# Altium schematic sheet Main_circuit.SchDoc
size A3
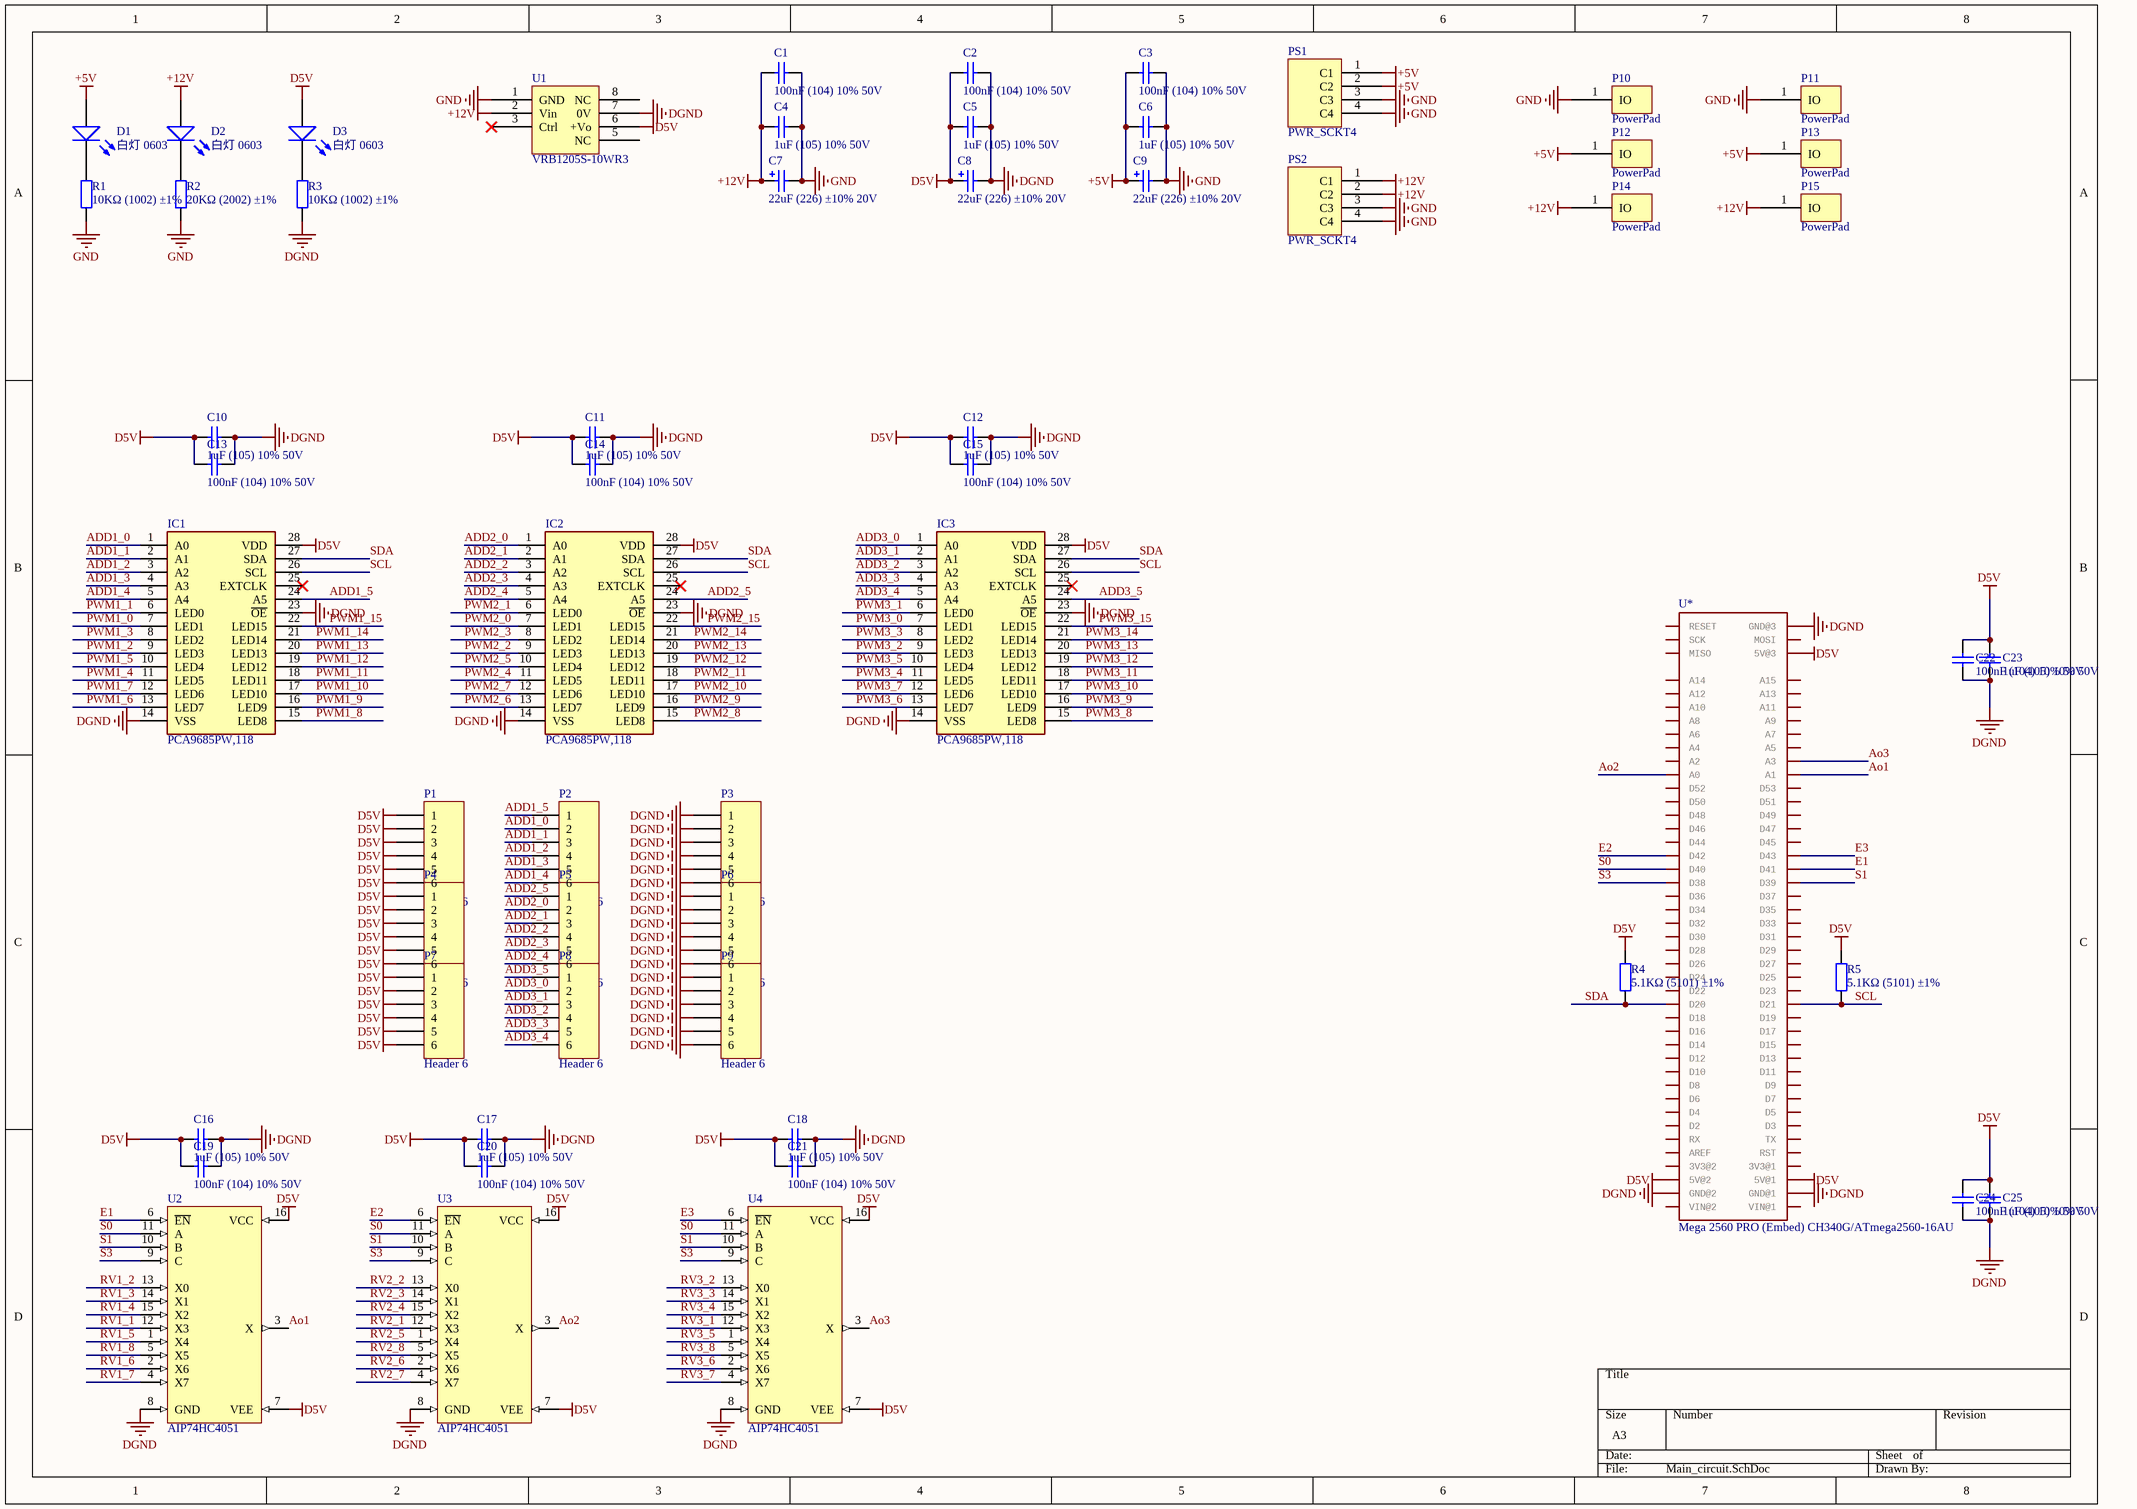
[diagram p0: Main_circuit.SchDoc]

## Parts
C1  100nF (104) 10% 50V  [LC-0603_C]
C2  100nF (104) 10% 50V  [LC-0603_C]
C3  100nF (104) 10% 50V  [LC-0603_C]
C4  1uF (105) 10% 50V  [LC-0603_C]
C5  1uF (105) 10% 50V  [LC-0603_C]
C6  1uF (105) 10% 50V  [LC-0603_C]
C7  22uF (226) ±10% 20V  [LC-CASE-B_3528]
C8  22uF (226) ±10% 20V  [LC-CASE-B_3528]
C9  22uF (226) ±10% 20V  [LC-CASE-B_3528]
C10  1uF (105) 10% 50V  [LC-0603_C]
C11  1uF (105) 10% 50V  [LC-0603_C]
C12  1uF (105) 10% 50V  [LC-0603_C]
C13  100nF (104) 10% 50V  [LC-0603_C]
C14  100nF (104) 10% 50V  [LC-0603_C]
C15  100nF (104) 10% 50V  [LC-0603_C]
C16  1uF (105) 10% 50V  [LC-0603_C]
C17  1uF (105) 10% 50V  [LC-0603_C]
C18  1uF (105) 10% 50V  [LC-0603_C]
C19  100nF (104) 10% 50V  [LC-0603_C]
C20  100nF (104) 10% 50V  [LC-0603_C]
C21  100nF (104) 10% 50V  [LC-0603_C]
C22  100nF (104) 10% 50V  [LC-0603_C]
C23  1uF (105) 10% 50V  [LC-0603_C]
C24  100nF (104) 10% 50V  [LC-0603_C]
C25  1uF (105) 10% 50V  [LC-0603_C]
D1  白灯 0603  [LC-0603_LED_S1]
D2  白灯 0603  [LC-0603_LED_S1]
D3  白灯 0603  [LC-0603_LED_S1]
IC1  PCA9685PW,118  [LC-TSSOP-28]
IC2  PCA9685PW,118  [LC-TSSOP-28]
IC3  PCA9685PW,118  [LC-TSSOP-28]
P1  Header 6  [HDR1X6]
P2  Header 6  [HDR1X6]
P3  Header 6  [HDR1X6]
P4  Header 6  [HDR1X6]
P5  Header 6  [HDR1X6]
P6  Header 6  [HDR1X6]
P7  Header 6  [HDR1X6]
P8  Header 6  [HDR1X6]
P9  Header 6  [HDR1X6]
P10  PowerPad  [PowerPad]
P11  PowerPad  [PowerPad]
P12  PowerPad  [PowerPad]
P13  PowerPad  [PowerPad]
P14  PowerPad  [PowerPad]
P15  PowerPad  [PowerPad]
PS1  PWR_SCKT4  [PWR_SCKT_4P3.81]
PS2  PWR_SCKT4  [PWR_SCKT_4P3.81]
R1  10KΩ (1002) ±1%  [LC-0603_R]
R2  20KΩ (2002) ±1%  [LC-0603_R]
R3  10KΩ (1002) ±1%  [LC-0603_R]
R4  5.1KΩ (5101) ±1%  [LC-0603_R]
R5  5.1KΩ (5101) ±1%  [LC-0603_R]
U1  VRB1205S-10WR3  [VRB1205S-10WR3]
U2  AIP74HC4051  [LC-SOP-16_150mil]
U3  AIP74HC4051  [LC-SOP-16_150mil]
U4  AIP74HC4051  [LC-SOP-16_150mil]
U*  Mega 2560 PRO (Embed) CH340G/ATmega2560-16AU  [Mega 2560 PRO (Embed)]

## Nets
+5V: C3.2 C6.2 C9.1 D1.A P12.1(IO) P13.1(IO) PS1.1(C1) PS1.2(C2)
+12V: C1.2 C4.2 C7.1 D2.A P14.1(IO) P15.1(IO) PS2.1(C1) PS2.2(C2) U1.2(Vin)
D5V: C2.2 C5.2 C8.1 C10.1 C11.1 C12.1 C13.1 C14.1 C15.1 C16.1 C17.1 C18.1 C19.1 C20.1 C21.1 C22.1 C23.1 C24.1 C25.1 D3.A IC1.28(VDD) IC2.28(VDD) IC3.28(VDD) P1.1 P1.2 P1.3 P1.4 P1.5 P1.6 P4.1 P4.2 P4.3 P4.4 P4.5 P4.6 P7.1 P7.2 P7.3 P7.4 P7.5 P7.6 R4.2 R5.2 U1.6(+Vo) U2.7(VEE) U2.16(VCC) U3.7(VEE) U3.16(VCC) U4.7(VEE) U4.16(VCC) U*.5V@1 U*.5V@2 U*.5V@3
DGND: C2.1 C5.1 C8.2 C10.2 C11.2 C12.2 C13.2 C14.2 C15.2 C16.2 C17.2 C18.2 C19.2 C20.2 C21.2 C22.2 C23.2 C24.2 C25.2 IC1.14(VSS) IC1.23(~{OE}) IC2.14(VSS) IC2.23(~{OE}) IC3.14(VSS) IC3.23(~{OE}) P3.1 P3.2 P3.3 P3.4 P3.5 P3.6 P6.1 P6.2 P6.3 P6.4 P6.5 P6.6 P9.1 P9.2 P9.3 P9.4 P9.5 P9.6 R3.1 U1.7(0V) U2.8(GND) U3.8(GND) U4.8(GND) U*.GND@1 U*.GND@2 U*.GND@3
GND: C1.1 C3.1 C4.1 C6.1 C7.2 C9.2 P10.1(IO) P11.1(IO) PS1.3(C3) PS1.4(C4) PS2.3(C3) PS2.4(C4) R1.1 R2.1 U1.1(GND)
ADD1_0: IC1.1(A0) P2.2
ADD1_1: IC1.2(A1) P2.3
ADD1_2: IC1.3(A2) P2.4
ADD1_3: IC1.4(A3) P2.5
ADD1_4: IC1.5(A4) P2.6
ADD1_5: IC1.24(A5) P2.1
ADD2_0: IC2.1(A0) P5.2
ADD2_1: IC2.2(A1) P5.3
ADD2_2: IC2.3(A2) P5.4
ADD2_3: IC2.4(A3) P5.5
ADD2_4: IC2.5(A4) P5.6
ADD2_5: IC2.24(A5) P5.1
ADD3_0: IC3.1(A0) P8.2
ADD3_1: IC3.2(A1) P8.3
ADD3_2: IC3.3(A2) P8.4
ADD3_3: IC3.4(A3) P8.5
ADD3_4: IC3.5(A4) P8.6
ADD3_5: IC3.24(A5) P8.1
Ao1: U2.3(X) U*.A1
Ao2: U3.3(X) U*.A0
Ao3: U4.3(X) U*.A3
E1: U2.6(~{EN}) U*.D41
E2: U3.6(~{EN}) U*.D42
E3: U4.6(~{EN}) U*.D43
PWM1_0: IC1.7(LED1)
PWM1_1: IC1.6(LED0)
PWM1_2: IC1.9(LED3)
PWM1_3: IC1.8(LED2)
PWM1_4: IC1.11(LED5)
PWM1_5: IC1.10(LED4)
PWM1_6: IC1.13(LED7)
PWM1_7: IC1.12(LED6)
PWM1_8: IC1.15(LED8)
PWM1_9: IC1.16(LED9)
PWM1_10: IC1.17(LED10)
PWM1_11: IC1.18(LED11)
PWM1_12: IC1.19(LED12)
PWM1_13: IC1.20(LED13)
PWM1_14: IC1.21(LED14)
PWM1_15: IC1.22(LED15)
PWM2_0: IC2.7(LED1)
PWM2_1: IC2.6(LED0)
PWM2_2: IC2.9(LED3)
PWM2_3: IC2.8(LED2)
PWM2_4: IC2.11(LED5)
PWM2_5: IC2.10(LED4)
PWM2_6: IC2.13(LED7)
PWM2_7: IC2.12(LED6)
PWM2_8: IC2.15(LED8)
PWM2_9: IC2.16(LED9)
PWM2_10: IC2.17(LED10)
PWM2_11: IC2.18(LED11)
PWM2_12: IC2.19(LED12)
PWM2_13: IC2.20(LED13)
PWM2_14: IC2.21(LED14)
PWM2_15: IC2.22(LED15)
PWM3_0: IC3.7(LED1)
PWM3_1: IC3.6(LED0)
PWM3_2: IC3.9(LED3)
PWM3_3: IC3.8(LED2)
PWM3_4: IC3.11(LED5)
PWM3_5: IC3.10(LED4)
PWM3_6: IC3.13(LED7)
PWM3_7: IC3.12(LED6)
PWM3_8: IC3.15(LED8)
PWM3_9: IC3.16(LED9)
PWM3_10: IC3.17(LED10)
PWM3_11: IC3.18(LED11)
PWM3_12: IC3.19(LED12)
PWM3_13: IC3.20(LED13)
PWM3_14: IC3.21(LED14)
PWM3_15: IC3.22(LED15)
RV1_1: U2.12(X3)
RV1_2: U2.13(X0)
RV1_3: U2.14(X1)
RV1_4: U2.15(X2)
RV1_5: U2.1(X4)
RV1_6: U2.2(X6)
RV1_7: U2.4(X7)
RV1_8: U2.5(X5)
RV2_1: U3.12(X3)
RV2_2: U3.13(X0)
RV2_3: U3.14(X1)
RV2_4: U3.15(X2)
RV2_5: U3.1(X4)
RV2_6: U3.2(X6)
RV2_7: U3.4(X7)
RV2_8: U3.5(X5)
RV3_1: U4.12(X3)
RV3_2: U4.13(X0)
RV3_3: U4.14(X1)
RV3_4: U4.15(X2)
RV3_5: U4.1(X4)
RV3_6: U4.2(X6)
RV3_7: U4.4(X7)
RV3_8: U4.5(X5)
S0: U2.11(A) U3.11(A) U4.11(A) U*.D40
S1: U2.10(B) U3.10(B) U4.10(B) U*.D39
S3: U2.9(C) U3.9(C) U4.9(C) U*.D38
SCL: IC1.26(SCL) IC2.26(SCL) IC3.26(SCL) R5.1 U*.D21
SDA: IC1.27(SDA) IC2.27(SDA) IC3.27(SDA) R4.1 U*.D20
NetD1_K: D1.K R1.2
NetD2_K: D2.K R2.2
NetD3_K: D3.K R3.2

Not connected (* = marked no-connect by the designer): IC1 25(EXTCLK)*; IC2 25(EXTCLK)*; IC3 25(EXTCLK)*; U1 3(Ctrl)* 5(NC) 8(NC); U* 3V3@1 3V3@2 A2 A4 A5 A6 A7 A8 A9 A10 A11 A12 A13 A14 A15 AREF D2 D3 D4 D5 D6 D7 D8 D9 D10 D11 D12 D13 D14 D15 D16 D17 D18 D19 D22 D23 D24 D25 D26 D27 D28 D29 D30 D31 D32 D33 D34 D35 D36 D37 D44 D45 D46 D47 D48 D49 D50 D51 D52 D53 MISO MOSI RESET RST RX SCK TX VIN@1 VIN@2

## Library data of the parts
C1-C3 C13-C15 C19-C22 C24 = 0603 100nF (104) 10% 50V: 贴片电容; ComponentLink1Description: 供应商链接; ComponentLink1URL: http://www.szlcsc.com/product/details_15331.html; Package: 0603; Supplier: LC; SuppliersPartNumber: C14663
C4-C6 C10-C12 C16-C18 C23 C25 = 0603 1uF (105) 10% 50V: 贴片电容; ComponentLink1Description: 供应商链接; ComponentLink1URL: http://www.szlcsc.com/product/details_16531.html; Package: 0603; Supplier: LC; SuppliersPartNumber: C15849
C7-C9 = 3216 10uF (106) 10% 16V: 钽电容; ComponentLink1Description: 供应商链接; ComponentLink1URL: http://www.szlcsc.com/product/details_7643.html; Package: 3528; Supplier: LC; SuppliersPartNumber: C122277
D1-D3 = 0603 白灯: 发光二极管; ComponentLink1Description: 供应商链接; ComponentLink1URL: http://www.szlcsc.com/product/details_2663.html; Package: 0603; Supplier: LC; SuppliersPartNumber: C2290
IC1-IC3 = PCA9685PW,118: Integrated Circuit; Manufacturer_Name: NXP; Datasheet Link: http://www.nxp.com/docs/en/data-sheet/PCA9685.pdf; Height: 1.1mm; SuppliersPartNumber: C92206; Package: TSSOP-28; Manufacturer_Part_Number: PCA9685PW,118
P1-P9 = Header 6: Header, 6-Pin; LatestRevisionDate: 17-Jul-2002; LatestRevisionNote: Re-released for DXP Platform.; Publisher: Altium Limited
PS1 PS2 = POWER_SOCKET4: POWER SOCKET
R1 R3 = 0603 10KΩ (1002) 1%: 贴片电阻; ComponentLink1Description: 供应商链接; ComponentLink1URL: http://www.szlcsc.com/product/details_26547.html; Package: 0603; Supplier: LC; SuppliersPartNumber: C25804
R2 = 0603 20KΩ (2002) 1%: 贴片电阻; ComponentLink1Description: 供应商链接; ComponentLink1URL: http://www.szlcsc.com/product/details_4591.html; Package: 0603; Supplier: LC; SuppliersPartNumber: C4184
R4 R5 = 0603 5.1KΩ (5101) 1%: 贴片电阻; ComponentLink1Description: 供应商链接; ComponentLink1URL: http://www.szlcsc.com/product/details_23913.html; Package: 0603; Supplier: LC; SuppliersPartNumber: C23186
U1 = VRB1205S-10WR3: Packge: Through Hole; SuppliersPartNumber: C970789
U2-U4 = CD4051BM96: 4000系列逻辑芯片; ComponentLink1Description: 供应商链接; ComponentLink1URL: http://www.szlcsc.com/product/details_22096.html; Package: SOP-16_150mil; Supplier: LC; SuppliersPartNumber: C93010
U* = Mega 2560 PRO (Embed): The Mega Pro Embed CH340G / ATmega2560 board is based on the ATmega2560 microcontroller and the USB-UART adapter CH340. The board is compatible with Arduino Mega 2560.